# Altium schematic sheet SAM4S_MCU_Hat.SchDoc: MCU Hat
size A3; DrawnBy: Group 19; Address1: ECE Department; Address2: University of Canterbury; Address3: Christchurch 8041; Address4: New Zealand; Revision: 1
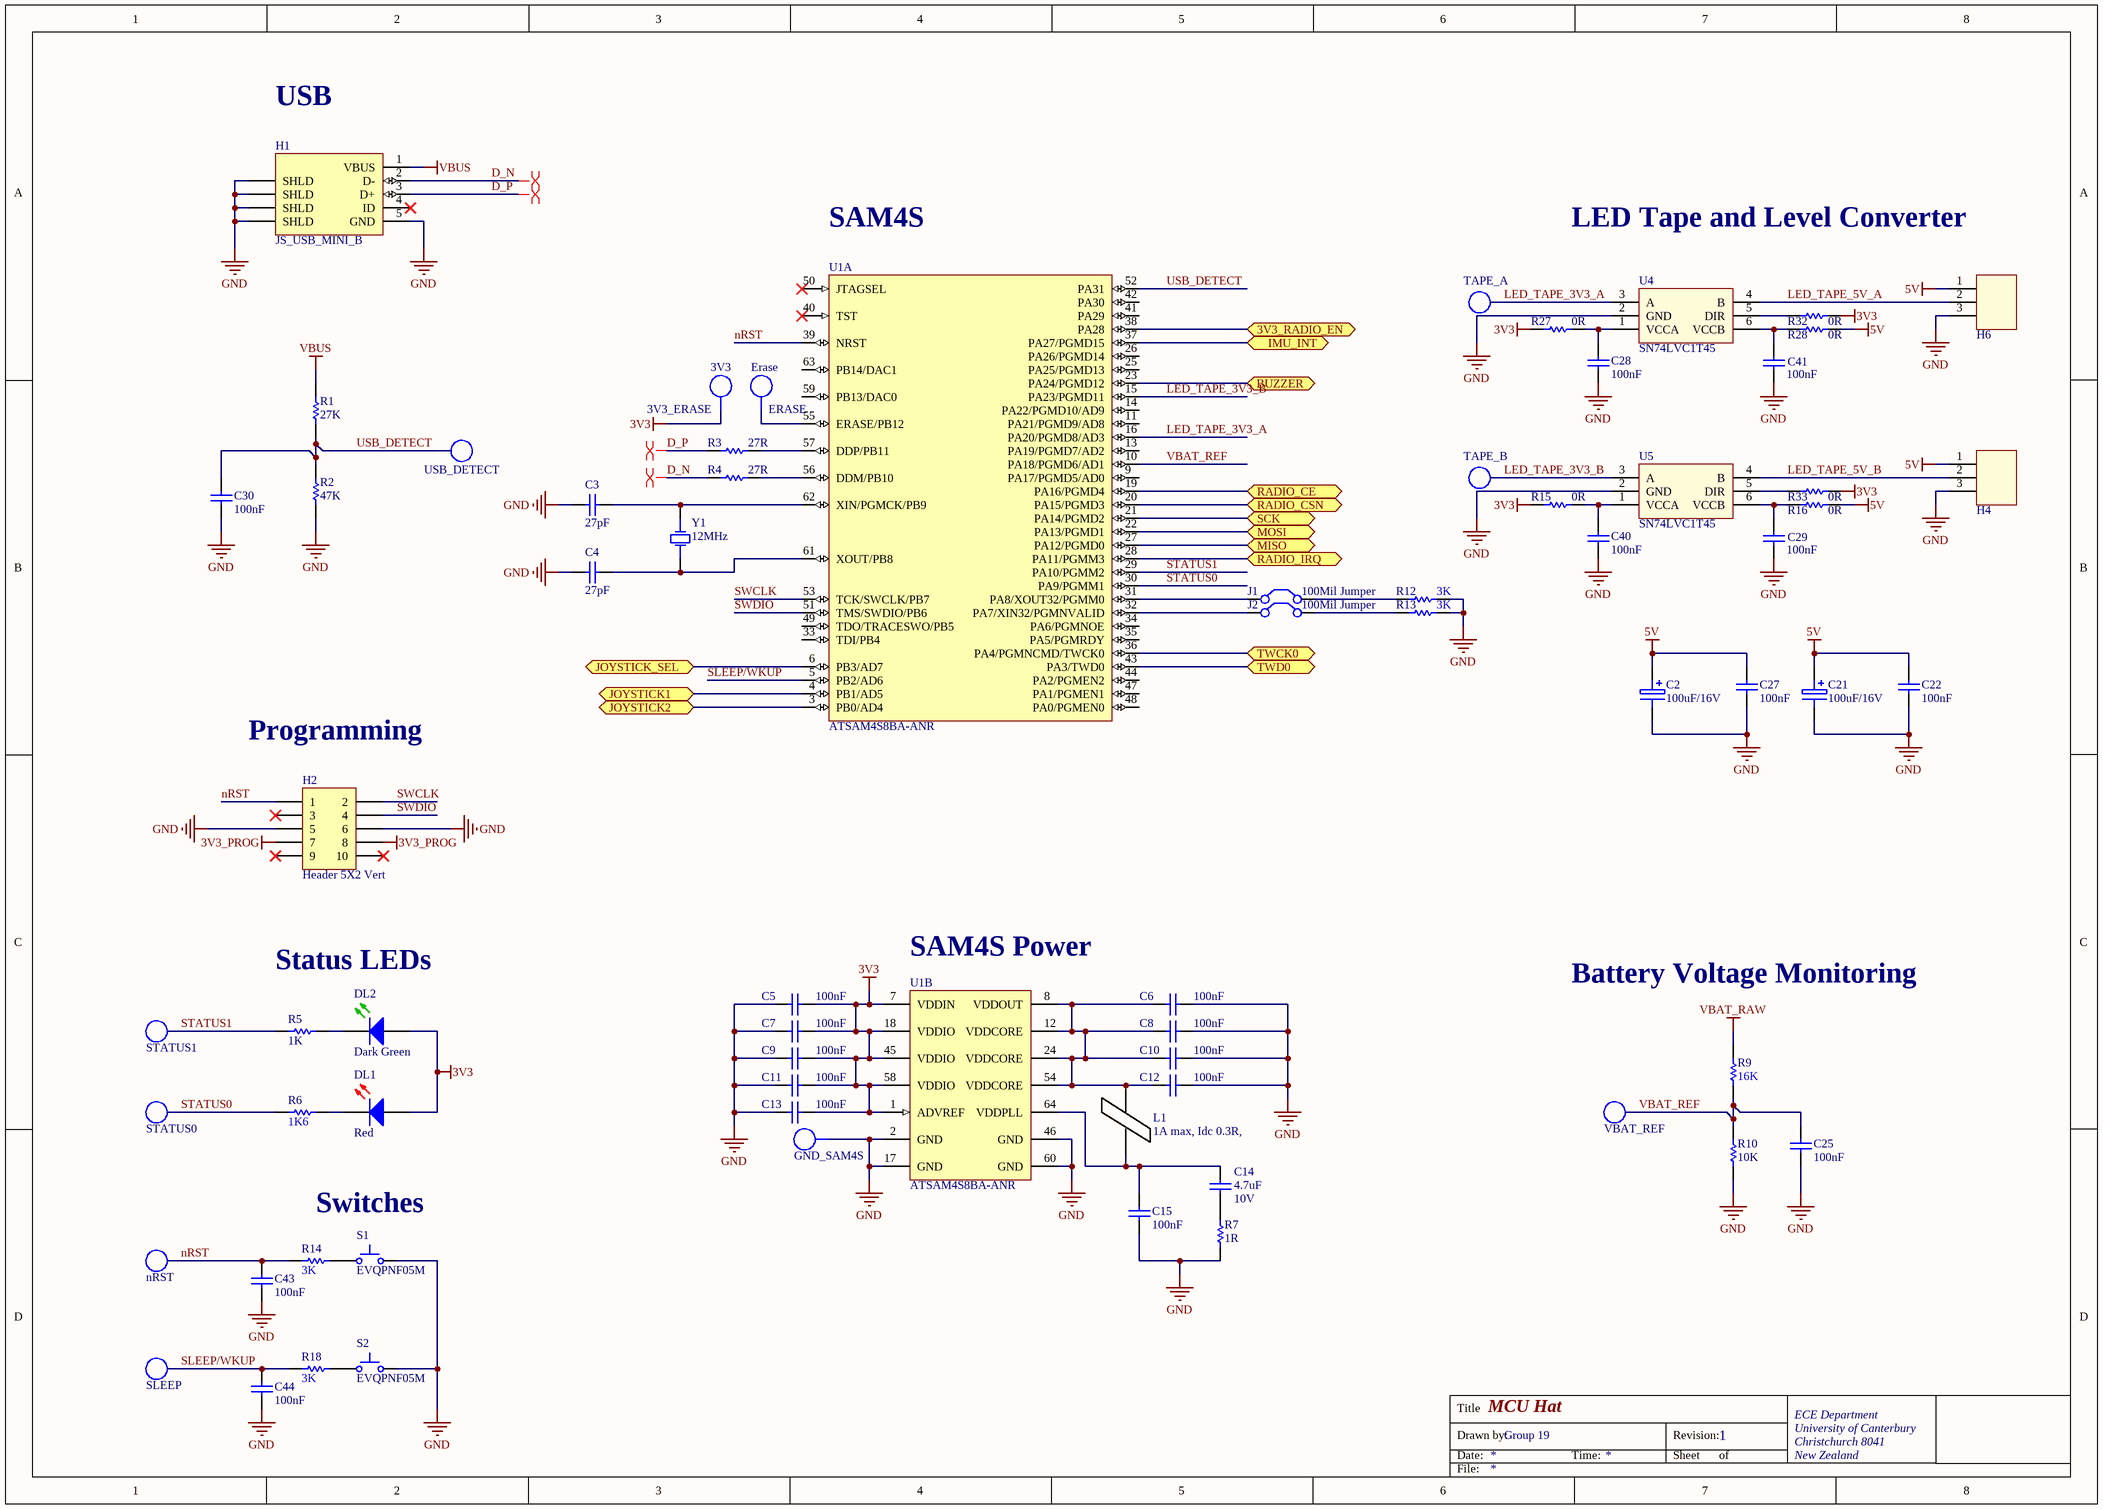
[diagram p0: SAM4S_MCU_Hat.SchDoc]

## Parts
3V3_ERASE  3V3  [TP_1206]  (no BOM)
C2  100uF/16V  [NICH-1]
C3  27pF  [CAPC1608L]
C4  27pF  [CAPC1608L]
C5  100nF  [CAPC1608L]
C6  100nF  [CAPC1608L]
C7  100nF  [CAPC1608L]
C8  100nF  [CAPC1608L]
C9  100nF  [CAPC1608L]
C10  100nF  [CAPC1608L]
C11  100nF  [CAPC1608L]
C12  100nF  [CAPC1608L]
C13  100nF  [CAPC1608L]
C14  Max Voltage: 10V  [CAPC1608N]  (hidden comment: 4.7uF)
C15  100nF  [CAPC1608L]
C21  100uF/16V  [NICH-1]
C22  100nF  [CAPC1608L]
C25  100nF  [CAPC1608L]
C27  100nF  [CAPC1608L]
C28  100nF  [CAPC1608L]
C29  100nF  [CAPC1608L]
C30  100nF  [CAPC1608L]
C40  100nF  [CAPC1608L]
C41  100nF  [CAPC1608L]
C43  100nF  [CAPC1608L]
C44  100nF  [CAPC1608L]
DL1  Red  [WL-SMCW0603]
DL2  Dark Green  [WL-SMCW0603]
ERASE  Erase  [TP_1206]  (no BOM)
GND_SAM4S  TP  [TP_1206]  (value not drawn)  (no BOM)
H1  JS_USB_MINI_B  [USB/SM0.8-6H5]
H2  Header 5X2 Vert  [IDC2.54-V10D]
H4  HEADER_3  [HEADER_3POS]  (value not drawn)
H6  HEADER_3  [HEADER_3POS]  (value not drawn)
J1  100Mil Jumper  [JMP2.54]
J2  100Mil Jumper  [JMP2.54]
L1  1A max, Idc 0.3R,  [INDC3216L]
nRST  TP_0603  [TP_0603]  (value not drawn)
R1  27K  [RESC1608L]
R2  47K  [RESC1608N]
R3  27R  [RESC1608L]
R4  27R  [RESC1608L]
R5  1K  [RESC1608L]
R6  1K6  [RESC1608L]
R7  1R  [RESC3216L]
R9  16K  [RESC1608L]
R10  10K  [RESC1608L]
R12  3K  [RESC1608L]
R13  3K  [RESC1608L]
R14  3K  [RESC1608L]
R15  0R  [RESC1608L]
R16  0R  [RESC1608L]
R18  3K  [RESC1608L]
R27  0R  [RESC1608L]
R28  0R  [RESC1608L]
R32  0R  [RESC1608L]
R33  0R  [RESC1608L]
S1  EVQPNF05M  [EVQPNF05M]
S2  EVQPNF05M  [EVQPNF05M]
SLEEP  TP_0603  [TP_0603]  (value not drawn)
STATUS0  TP_0603  [TP_0603]  (value not drawn)
STATUS1  TP_0603  [TP_0603]  (value not drawn)
TAPE_A  TP_0603  [TP_0603]  (value not drawn)
TAPE_B  TP_0603  [TP_0603]  (value not drawn)
U1  ATSAM4S8BA-ANR  [LQFP64_L]  (parts A,B of 2)
U4  SN74LVC1T45  [SOT23-6_N]
U5  SN74LVC1T45  [SOT23-6_N]
USB_DETECT  TP_0603  [TP_0603]  (value not drawn)
VBAT_REF  TP_0603  [TP_0603]  (value not drawn)
Y1  12MHz  [6.0X3.5-4]

## Ports
3V3_RADIO_EN (bidir), BUZZER (bidir), IMU_INT (bidir), JOYSTICK1 (bidir), JOYSTICK2 (bidir), JOYSTICK_SEL (bidir), MISO (bidir), MOSI (bidir), RADIO_CE (bidir), RADIO_CSN (bidir), RADIO_IRQ (bidir), SCK (bidir), TWCK0 (bidir), TWD0 (bidir)

## Nets
3V3: 3V3_ERASE.1 C5.2 C7.2 C9.2 C11.2 C13.2 DL1.2(A) DL2.2(A) R15.1 R27.1 R32.2 R33.2 U1.1(ADVREF) U1.7(VDDIN) U1.18(VDDIO) U1.45(VDDIO) U1.58(VDDIO)
3V3_PROG: H2.7 H2.8
5V: C2.2 C21.2 C22.2 C27.2 H4.1 H6.1 R16.2 R28.2
GND: C2.1 C3.1 C4.1 C5.1 C6.2 C7.1 C8.2 C9.1 C10.2 C11.1 C12.2 C13.1 C15.2 C21.1 C22.1 C25.1 C27.1 C28.1 C29.1 C30.1 C40.1 C41.1 C43.1 C44.1 GND_SAM4S.1 H1.5(GND) H1.6(SHLD) H1.7(SHLD) H1.8(SHLD) H1.9(SHLD) H2.5 H2.6 H4.3 H6.3 R2.1 R7.1 R10.1 R12.2 R13.2 S1.1 S2.1 U1.2(GND) U1.17(GND) U1.46(GND) U1.60(GND) U4.2(GND) U5.2(GND)
VBAT_RAW: R9.2
VBUS: H1.1(VBUS) R1.2
3V3_RADIO_EN: U1.38(PA28) ; port 3V3_RADIO_EN
BUZZER: U1.23(PA24/PGMD12) ; port BUZZER
D_N: H1.2(D-) R4.1
D_P: H1.3(D+) R3.1
IMU_INT: U1.37(PA27/PGMD15) ; port IMU_INT
JOYSTICK1: U1.4(PB1/AD5) ; port JOYSTICK1
JOYSTICK2: U1.3(PB0/AD4) ; port JOYSTICK2
JOYSTICK_SEL: U1.6(PB3/AD7) ; port JOYSTICK_SEL
LED_TAPE_3V3_A: TAPE_A.1(TP) U1.16(PA20/PGMD8/AD3) U4.3(A)
LED_TAPE_3V3_B: TAPE_B.1(TP) U1.15(PA23/PGMD11) U5.3(A)
LED_TAPE_5V_A: H6.2 U4.4(B)
LED_TAPE_5V_B: H4.2 U5.4(B)
MISO: U1.27(PA12/PGMD0) ; port MISO
MOSI: U1.22(PA13/PGMD1) ; port MOSI
nRST: C43.2 H2.1 nRST.1(TP) R14.1 U1.39(NRST)
RADIO_CE: U1.19(PA16/PGMD4) ; port RADIO_CE
RADIO_CSN: U1.20(PA15/PGMD3) ; port RADIO_CSN
RADIO_IRQ: U1.28(PA11/PGMM3) ; port RADIO_IRQ
SCK: U1.21(PA14/PGMD2) ; port SCK
SLEEP/WKUP: C44.2 R18.1 SLEEP.1(TP) U1.5(PB2/AD6)
STATUS0: R6.1 STATUS0.1(TP) U1.30(PA9/PGMM1)
STATUS1: R5.1 STATUS1.1(TP) U1.29(PA10/PGMM2)
SWCLK: H2.2 U1.53(TCK/SWCLK/PB7)
SWDIO: H2.4 U1.51(TMS/SWDIO/PB6)
TWCK0: U1.36(PA4/PGMNCMD/TWCK0) ; port TWCK0
TWD0: U1.43(PA3/TWD0) ; port TWD0
USB_DETECT: C30.2 R1.1 R2.2 U1.52(PA31) USB_DETECT.1(TP)
VBAT_REF: C25.2 R9.1 R10.2 U1.10(PA18/PGMD6/AD1) VBAT_REF.1(TP)
NetC3_2: C3.2 U1.62(XIN/PGMCK/PB9) Y1.3(OSC2)
NetC4_2: C4.2 U1.61(XOUT/PB8) Y1.1(OSC1)
NetC6_1: C6.1 C8.1 C10.1 C12.1 L1.2 U1.8(VDDOUT) U1.12(VDDCORE) U1.24(VDDCORE) U1.54(VDDCORE)
NetC14_1: C14.1 R7.2
NetC14_2: C14.2 C15.1 L1.1 U1.64(VDDPLL)
NetC28_2: C28.2 R27.2 U4.1(VCCA)
NetC29_2: C29.2 R16.1 U5.6(VCCB)
NetC40_2: C40.2 R15.2 U5.1(VCCA)
NetC41_2: C41.2 R28.1 U4.6(VCCB)
NetDL1_1: DL1.1(K) R6.2
NetDL2_1: DL2.1(K) R5.2
NetERASE_1: ERASE.1 U1.55(ERASE/PB12)
NetJ1_1: J1.1(C1) U1.31(PA8/XOUT32/PGMM0)
NetJ1_2: J1.2(C2) R12.1
NetJ2_1: J2.1(C1) U1.32(PA7/XIN32/PGMNVALID)
NetJ2_2: J2.2(C2) R13.1
NetR3_2: R3.2 U1.57(DDP/PB11)
NetR4_2: R4.2 U1.56(DDM/PB10)
NetR14_2: R14.2 S1.2
NetR18_2: R18.2 S2.2
NetR32_1: R32.1 U4.5(DIR)
NetR33_1: R33.1 U5.5(DIR)

Not connected (* = marked no-connect by the designer): H1 4(ID)*; H2 3* 9* 10*; U1 9(PA17/PGMD5/AD0) 11(PA21/PGMD9/AD8) 13(PA19/PGMD7/AD2) 14(PA22/PGMD10/AD9) 25(PA25/PGMD13) 26(PA26/PGMD14) 33(TDI/PB4) 34(PA6/PGMNOE) 35(PA5/PGMRDY) 40(TST)* 41(PA29) 42(PA30) 44(PA2/PGMEN2) 47(PA1/PGMEN1) 48(PA0/PGMEN0) 49(TDO/TRACESWO/PB5) 50(JTAGSEL)* 59(PB13/DAC0) 63(PB14/DAC1)

## Layout directives
differential pair: D_N, D_P

## Notes on the sheet
- USB
- SAM4S
- LED Tape and Level Converter
- Programming
- Status LEDs
- (near U1) SAM4S Power
- Battery Voltage Monitoring
- Switches
- Title
- Drawn by:
- Date:
- Time:
- Revision:
- Sheet
- of
- File:

## Library data of the parts
3V3_ERASE ERASE = TP_1206: Test-Point 3.3x1.6x2.1mm SMD; Manufacturer: Harwin Inc; Manufacturer Part Number: S1751-46R; Value: TP; Manufacturer PN: *; Storage Location: ProtoPlace; Mounting Type: Surface Mount; Type: PC Test Point; Supplier 1: Digi-Key; Supplier Part Number 1: 952-1478-2-ND; Supplier 2: Farnell; Supplier Part Number 2: 1826282; Supplier: ECE Dept
C2 C21 = CA_100uF_16V: CAP ALUM 100uF 16V SMD; Manufacturer PN: UWX1C101MCL1GB; Manufacturer: Nichcon; Supplier 1: Farnell; Supplier Part Number 1: 1870677; Storage Location: PCB Assembly WS; Supplier: ECE Dept; Supplier 2: Digi-Key; Supplier Part Number 2: 493-2105-1-ND; Value: 100uF/16V
C3 C4 = CC_27pF_0603: CAP CER 27pF NPO/COG +-5% 50V 0603; PackageReference: 0603; Code_IPC: 1608 [0603]; Verify: *; Supplier: ECE Dept; Storage Location: PCB Assembly WS; Value: 27pF
C5-C13 C15 C22 C25 C27-C30 C40 C41 C43 C44 = CC_100nF_0603: CAP CER 100nF X7R +-10% 50V 0603; PackageReference: 0603; Code_IPC: 1608 [0603]; Verify: *; Supplier: ECE Dept; Storage Location: PCB Assembly WS; Value: 100nF
C14 = CC_4.7uF_0603: CAP CER 4.7uF X5R +-20%  10V 0603; Note: Footprint corresponds to dimensions for bulk cassette packaging. This case size has tightened tolerances.; PackageReference: 0805; Code_IPC: 2012[0805]; Verify: *; Supplier: ECE Dept; Storage Location: PCB Assembly WS; Value: 4.7uF
DL1 = DL_150060RS75000: LED Red 250mcd 0603 SMD; Manufacturer: WURTH ELEKTRONIK; Forward Current If: 30; Forward Voltage: 2; Lens Shape: Rectangular; Luminous Intensity: 250; Wavelength Typ: 625; Viewing Angle: 140°; LED Mounting: SMD; Supplier 1: Farnell; Supplier Part Number 1: 2322071; Manufacturer Part Number: 150060RS75000; Storage Location: PCB Assembly WS; Supplier: ECE Dept; LED Colour: Red
DL2 = DL_150060GS75000: LED Dk Green 430mcd 0603 SMD; Manufacturer: WURTH ELEKTRONIK; Forward Current If: 30; Wavelength Typ: 520; Forward Voltage: 3.2; Lens Shape: Rectangular; Luminous Intensity: 430; Viewing Angle: 140°; LED Mounting: SMD; Supplier 1: Farnell; Supplier Part Number 1: 2322070; Manufacturer Part Number: 150060GS75000; Storage Location: PCB Assembly WS; Supplier: ECE Dept; LED Colour: Dark Green
GND_SAM4S = TP_1206: Test-Point 3.3x1.6x2.1mm SMD; Manufacturer: Harwin Inc; Manufacturer Part Number: S1751-46R; Manufacturer PN: *; Storage Location: ProtoPlace; Mounting Type: Surface Mount; Type: PC Test Point; Supplier 1: Digi-Key; Supplier Part Number 1: 952-1478-2-ND; Supplier 2: Farnell; Supplier Part Number 2: 1826282; Supplier: ECE Dept; Value: TP
H1 = JS_USB_MINI_B_SMT: USB 2.0, Right Angle, SMT, B Type, Receptacle, 5 Position,; Manufacturer: FCI; Manufacturer PN: 10033526-N3212MLF; Supplier 1: Farnell; Supplier Part Number 1: 1824416; Storage Location: PCB Assembly WS; Supplier: ECE Dept
H2 = JA_HDR_IDC_5X2_VERT: IDC Header, 2,54mm, 10-Pin, Vert; Supplier: ECE Dept; Supplier 1: Farnell; Supplier Part Number 1: 1096985; Storage Location: ECE Dept Store
H4 H6 = HEADER_3: 3Pin Header 2.54mm spacing
J1 J2 = TP_JUMPER: 2.54mm Jumper Thru Hole; Pitch Spacing: 2.54; No. of Rows: 1; No. of Positions: 2; Supplier: ECE Dept; Supplier 1: Farnell; Supplier Part Number 1: 1097975; Storage Location: ECE$ Store
L1 = IN_Ferrite-Bead: Ferrite Bead, Rdc 0.3R, Z100MHZ 600R, Imax 1A, SMD 1206; Manufacturer: FAIR-RITE; Manufacturer PN: 2512066017Y1; DC Current Rating: 1; DC Resistance Max: 0.08; Ferrite Case Style: 1206 ^3216 Metric]; Frequency Range: 50MHz to 1; Impedance: 600; Impedance Tolerance: ± 25%; Supplier: ECE Dept; Storage Location: PCB Assembly WS; Ferrite Mounting: SMD; Supplier 1: Farnell; Supplier Part Number 1: 1612060; Manufacturer Part Number: 2512066017Y1; Value: 1A max, Idc 0.3R,
nRST SLEEP STATUS0 STATUS1 TAPE_A TAPE_B USB_DETECT VBAT_REF = TP_0603: Test Point 1.65X0.9X1.2mm SMD; Manufacturer: TE Connectivity AMP Connectors; Manufacturer Part Number: 1625854-3; Supplier 1: Digi-Key; Mounting Type: Surface Mount; Terminal: 0.063" x 0.031" x 0.045" (1.60mm x 0.80mm x 1.15mm); Type: PC Test Point; Supplier Part Number 1: A106145CT-ND
R1 = RS_27K: RES 27K OHM 1/10W 5% 0603 SMD; Storage Location: PCB Assembly WS; Supplier: ECE Dept; Value: 27K
R2 = RS_47K: RES 47.0K OHM 1/10W 5% 0603 SMD; Storage Location: PCB Assembly WS; Supplier: ECE Dept; Value: 47K
R3 R4 = RS_27R: RES 27 OHM 1/10W 5% 0603 SMD; Storage Location: PCB Assembly WS; Supplier: ECE Dept; Value: 27R
R5 = RS_1K: RES 1.0K OHM 1/10W 5% 0603 SMD; Storage Location: PCB Assembly WS; Supplier: ECE Dept; Value: 1K
R6 = RS_1K6: RES 1.6K OHM 1/10W 5% 0603 SMD; Storage Location: PCB Assembly WS; Supplier: ECE Dept; Value: 1K6
R7 = RT_1R: RES 1R OHM 1/4W 5% 1206 SMD; Storage Location: PCB Assembly WS; Supplier: ECE Dept; Value: 1R
R9 = RS_16K: RES 16K OHM 1/10W 5% 0603 SMD; Storage Location: PCB Assembly WS; Supplier: ECE Dept; Value: 16K
R10 = RS_10K: RES 10.0K OHM 1/10W 5% 0603 SMD; Storage Location: PCB Assembly WS; Supplier: ECE Dept; Value: 10K
R12-R14 R18 = RS_3K: RES 3K OHM 1/10W 5% 0603 SMD; Storage Location: PCB Assembly WS; Supplier: ECE Dept; Value: 3K
R15 R16 R27 R28 R32 R33 = RS_0R0: RES 0.0 OHM 1/10W 5% 0603 SMD; Storage Location: PCB Assembly WS; Supplier: ECE Dept; Value: 0R
S1 S2 = WS_EVQPNF05M: Panasonic 6 x 3.5mm SMD Light Touch Switch Type SMD; PackageDescription: 6.0 x 3.5 mm; Supplier 1: Farnell; Supplier Part Number 1: 2079481; Manufacturer: Panasonic; Manufacturer PN: EVQPNF05M; Supplier 2: Digi-Key; Supplier Part Number 2: P13598SCT-ND; Storage Location: PCB Assembly WS; Supplier: ECE Dept
U1 = SE_ATSAM4S16BA-MU: IC MCU 32BIT 512KB FLASH 64LQFP; Manufacturer: Atmel; Connectivity: I²C, IrDA, Memory Card, SPI, SSC, UART/USART, USB; Core Processor: ARM® Cortex®-M4; Core Size: 32-Bit; Data Converters: A/D 11x12b, D/A 2x12b; Number of I/O: 47; Peripherals: Brown-out Detect/Reset, DMA, POR, PWM, WDT; Program Memory Size: 512KB (512K x 8); RAM Size: 128K x 8; Speed: 120MHz; Voltage - Supply (Vcc/Vdd): 1.62 V ~ 3.6 V; PackageVersion: revJ, Jul-2007; PackageReference: 64PS; PackageDescription: 64-Pin Quad Flat No-Lead (QFN) Sawn, 9 x 9 x 1.0 mm Body, 0.5 mm Pitch, Exposed Pad; Code_JEDEC: MO-220VMMD-3; ComponentLink1Description: Manufacturer URL; ComponentLink1URL: http://www.atmel.com/; ComponentLink2Description: SAM4S Series Datasheet; ComponentLink2URL: http://www.atmel.com/dyn/resources/prod_documents/11100.pdf; ComponentLink3Description: SAM4S Series Summary; ComponentLink3URL: http://www.atmel.com/dyn/resources/prod_documents/11100S.pdf; Supplier 1: Digi-Key; Package / Case: 64-LQFP; Packaging: Cut Tape (CT); Program Memory Type: FLASH; Supplier Part Number 1: ATSAM4S8BA-ANRCT-ND; Manufacturer Part Number: ATSAM4S8BA-ANR
U4 U5 = SN74LVC1T45: 1.8V - 5V level converter
Y1 = XT_CRYSTAL_12MHz_18pF: CRYSTAL 12MHZ 18PF 6X3.5mm SMD; Manufacturer: CTS-Frequency Controls; Manufacturer Part Number: 406C35D12M00000; ESR (Equivalent Series Resistance): 60 Ohm; Frequency Stability: ±50ppm; Frequency Tolerance: ±30ppm; Operating Mode: Fundamental; Supplier 1: Digi-Key; Height: 0.047" (1.20mm); Load Capacitance: 18pF; Mounting Type: Surface Mount; Operating Temperature: -20°C ~ 70°C; Package / Case: 4-SMD, No Lead (DFN, LCC); Size / Dimension: 0.236" L x 0.138" W (6.00mm x 3.50mm); Supplier Part Number 1: CTX855CT-ND; Frequency: 12MHz